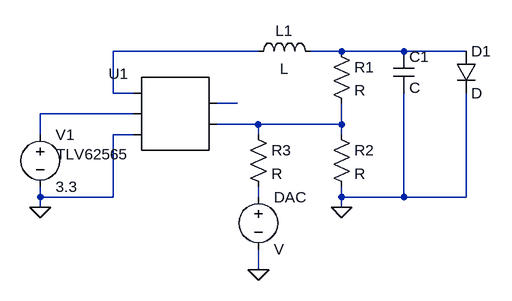
[diagram p0: schematic Draft2.asc]
Draft2.asc, the LTspice schematic file:
Version 4
SHEET 1 880 680
WIRE 320 -176 96 -176
WIRE 448 -176 400 -176
WIRE 544 -176 448 -176
WIRE 640 -176 544 -176
WIRE 96 -112 96 -176
WIRE 128 -112 96 -112
WIRE 288 -96 256 -96
WIRE 128 -80 -16 -80
WIRE 320 -64 256 -64
WIRE 448 -64 448 -96
WIRE 448 -64 320 -64
WIRE -16 -48 -16 -80
WIRE 128 -48 96 -48
WIRE 320 -48 320 -64
WIRE 448 -48 448 -64
WIRE -16 48 -16 32
WIRE 96 48 96 -48
WIRE 96 48 -16 48
WIRE 320 48 320 32
WIRE 448 48 448 32
WIRE 544 48 544 -112
WIRE 544 48 448 48
WIRE 640 48 640 -112
WIRE 640 48 544 48
WIRE -16 64 -16 48
WIRE 448 64 448 48
WIRE 320 160 320 128
FLAG -16 64 0
FLAG 320 160 0
FLAG 448 64 0
SYMBOL AutoGenerated\\TLV62565 192 -80 M0
SYMATTR InstName U1
SYMBOL voltage 320 32 R0
SYMATTR InstName DAC
SYMBOL voltage -16 -64 R0
WINDOW 123 0 0 Left 0
WINDOW 39 0 0 Left 0
SYMATTR InstName V1
SYMATTR Value 3.3
SYMBOL ind 304 -160 R270
WINDOW 0 32 56 VTop 2
WINDOW 3 5 56 VBottom 2
SYMATTR InstName L1
SYMBOL cap 528 -176 R0
SYMATTR InstName C1
SYMBOL res 432 -192 R0
SYMATTR InstName R1
SYMBOL res 432 -64 R0
SYMATTR InstName R2
SYMBOL res 304 -64 R0
SYMATTR InstName R3
SYMBOL diode 624 -176 R0
SYMATTR InstName D1

The netlist it stands for:
* Draft2.asc
* U1: TLV62565 (symbol AutoGenerated\TLV62565 not available, pins judged from their places): pin1=N003 pin2=N005 pin3=N001 pin4=N004 pin5=0
V§DAC N006 0 V
V1 N004 0 3.3
L1 N001 N002 L
C1 N002 0 C
R1 N002 N005 R
R2 N005 0 R
R3 N005 N006 R
D1 N002 0 D
.model D D
.lib standard.dio
.backanno
.end